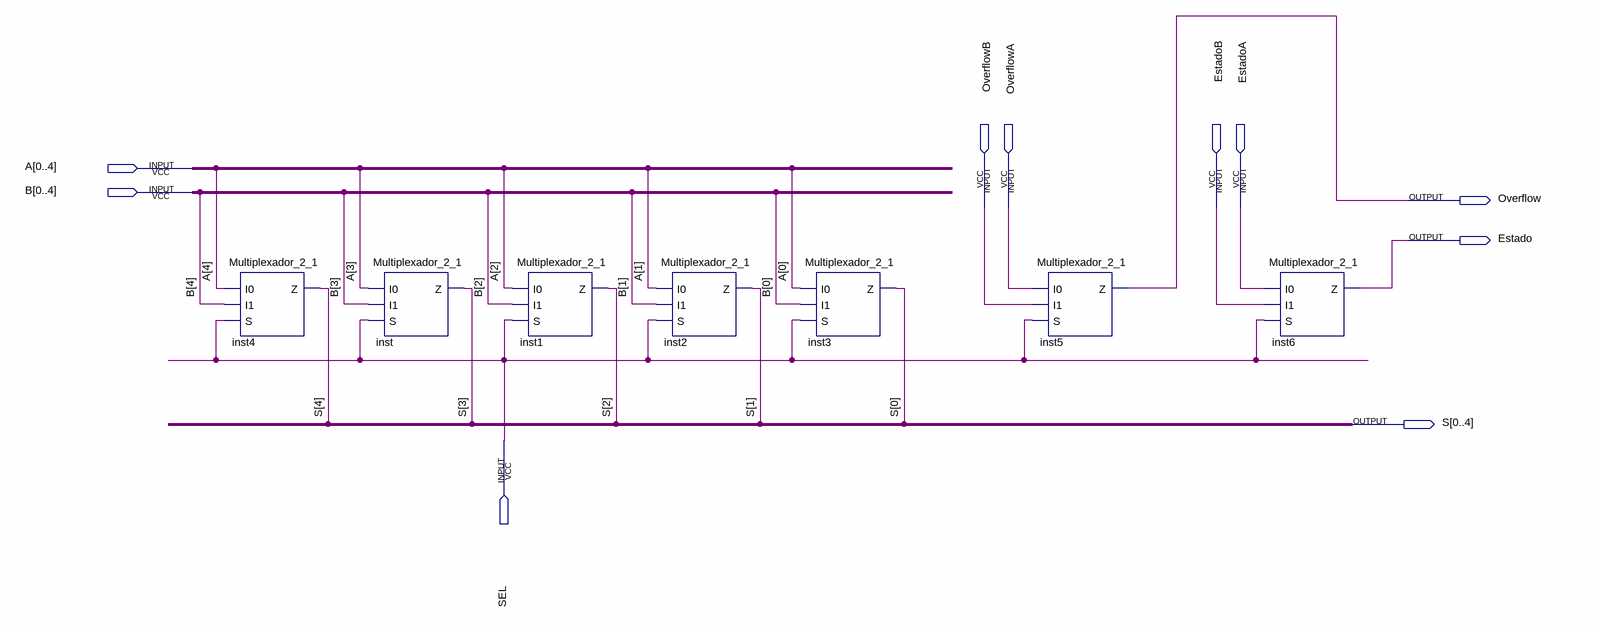
[diagram p0: schematic sheet]
// Quartus schematic Multiplexador_Final.bdf as structural Verilog: 7 symbols, 10 pins
module Multiplexador_Final (
  input  [0:4] A,
  input  [0:4] B,
  input  OverflowB,
  input  OverflowA,
  input  EstadoB,
  input  EstadoA,
  input  SEL,
  output Overflow,
  output Estado,
  output [0:4] S
);

  Multiplexador_2_1 inst4 (.I0(A[4]), .I1(B[4]), .S(SEL), .Z(S[4]));
  Multiplexador_2_1 inst (.I0(A[3]), .I1(B[3]), .S(SEL), .Z(S[3]));
  Multiplexador_2_1 inst1 (.I0(A[2]), .I1(B[2]), .S(SEL), .Z(S[2]));
  Multiplexador_2_1 inst2 (.I0(A[1]), .I1(B[1]), .S(SEL), .Z(S[1]));
  Multiplexador_2_1 inst3 (.I0(A[0]), .I1(B[0]), .S(SEL), .Z(S[0]));
  Multiplexador_2_1 inst5 (.I0(OverflowA), .I1(OverflowB), .S(SEL), .Z(Overflow));
  Multiplexador_2_1 inst6 (.I0(EstadoA), .I1(EstadoB), .S(SEL), .Z(Estado));
endmodule
